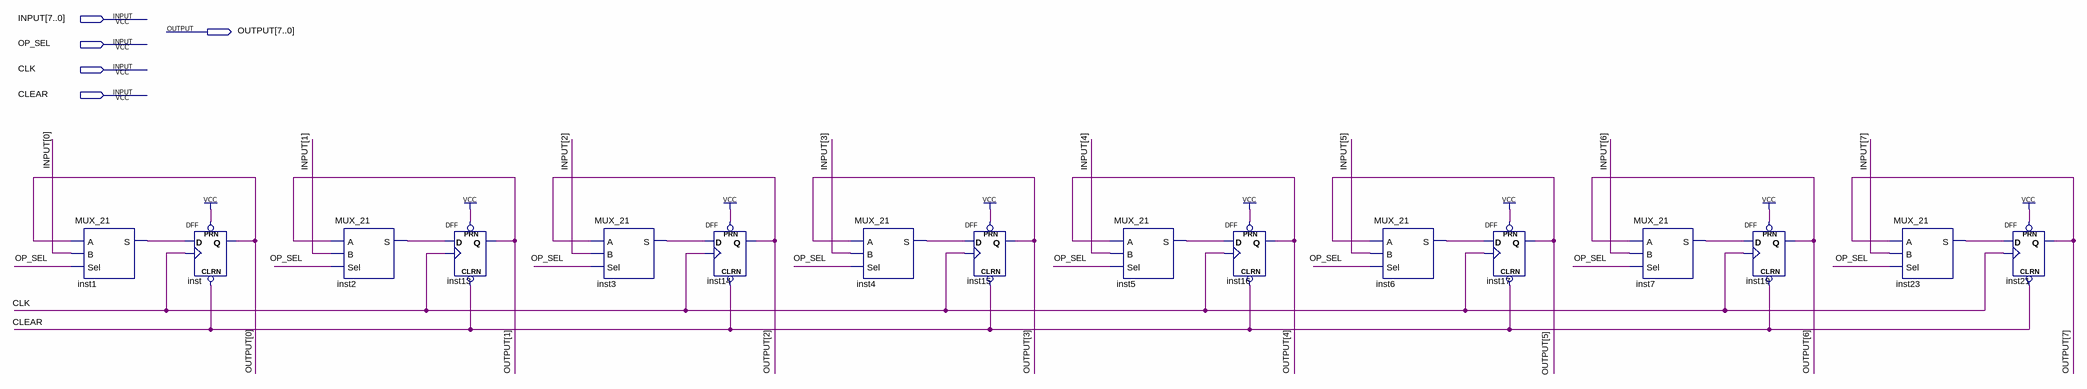
[diagram p0: schematic sheet]
// Quartus schematic EIGHT_BIT_REGISTER.bdf as structural Verilog: 16 symbols, 5 pins
module EIGHT_BIT_REGISTER (
  input  [7:0] INPUT,
  input  OP_SEL,
  input  CLK,
  input  CLEAR,
  output [7:0] OUTPUT
);

  wire inst1_s, inst2_s, inst3_s, inst4_s, inst5_s, inst6_s, inst7_s, inst23_s;

  MUX_21 inst1 (.A(OUTPUT[0]), .B(INPUT[0]), .Sel(OP_SEL), .S(inst1_s));
  DFF inst (.CLRN(CLEAR), .CLK(CLK), .D(inst1_s), .PRN(1'b1), .Q(OUTPUT[0]));
  MUX_21 inst2 (.A(OUTPUT[1]), .B(INPUT[1]), .Sel(OP_SEL), .S(inst2_s));
  DFF inst13 (.CLRN(CLEAR), .CLK(CLK), .D(inst2_s), .PRN(1'b1), .Q(OUTPUT[1]));
  MUX_21 inst3 (.A(OUTPUT[2]), .B(INPUT[2]), .Sel(OP_SEL), .S(inst3_s));
  DFF inst14 (.CLRN(CLEAR), .CLK(CLK), .D(inst3_s), .PRN(1'b1), .Q(OUTPUT[2]));
  MUX_21 inst4 (.A(OUTPUT[3]), .B(INPUT[3]), .Sel(OP_SEL), .S(inst4_s));
  DFF inst15 (.CLRN(CLEAR), .CLK(CLK), .D(inst4_s), .PRN(1'b1), .Q(OUTPUT[3]));
  MUX_21 inst5 (.A(OUTPUT[4]), .B(INPUT[4]), .Sel(OP_SEL), .S(inst5_s));
  DFF inst16 (.CLRN(CLEAR), .CLK(CLK), .D(inst5_s), .PRN(1'b1), .Q(OUTPUT[4]));
  MUX_21 inst6 (.A(OUTPUT[5]), .B(INPUT[5]), .Sel(OP_SEL), .S(inst6_s));
  DFF inst17 (.CLRN(CLEAR), .CLK(CLK), .D(inst6_s), .PRN(1'b1), .Q(OUTPUT[5]));
  MUX_21 inst7 (.A(OUTPUT[6]), .B(INPUT[6]), .Sel(OP_SEL), .S(inst7_s));
  DFF inst19 (.CLRN(CLEAR), .CLK(CLK), .D(inst7_s), .PRN(1'b1), .Q(OUTPUT[6]));
  MUX_21 inst23 (.A(OUTPUT[7]), .B(INPUT[7]), .Sel(OP_SEL), .S(inst23_s));
  DFF inst21 (.CLRN(CLEAR), .CLK(CLK), .D(inst23_s), .PRN(1'b1), .Q(OUTPUT[7]));
endmodule
